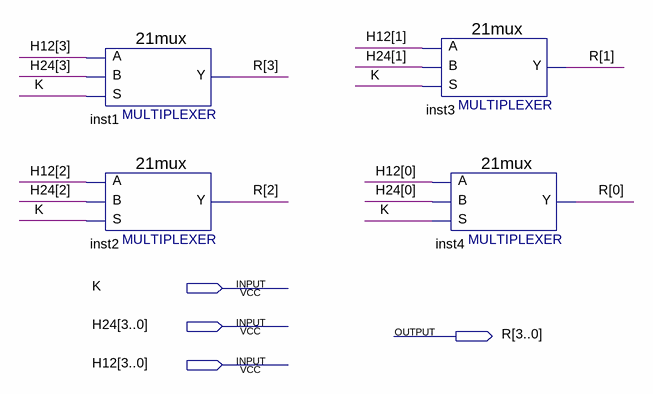
[diagram p0: schematic sheet]
// Quartus schematic 12-24.bdf as structural Verilog: 4 symbols, 4 pins
module \12-24  (
  input  K,
  input  [3:0] H24,
  input  [3:0] H12,
  output [3:0] R
);

  \21mux  inst1 (.S(K), .B(H24[3]), .A(H12[3]), .Y(R[3]));
  \21mux  inst2 (.S(K), .B(H24[2]), .A(H12[2]), .Y(R[2]));
  \21mux  inst3 (.S(K), .B(H24[1]), .A(H12[1]), .Y(R[1]));
  \21mux  inst4 (.S(K), .B(H24[0]), .A(H12[0]), .Y(R[0]));
endmodule
